# EAGLE design oeuil (EAGLE 6.3)
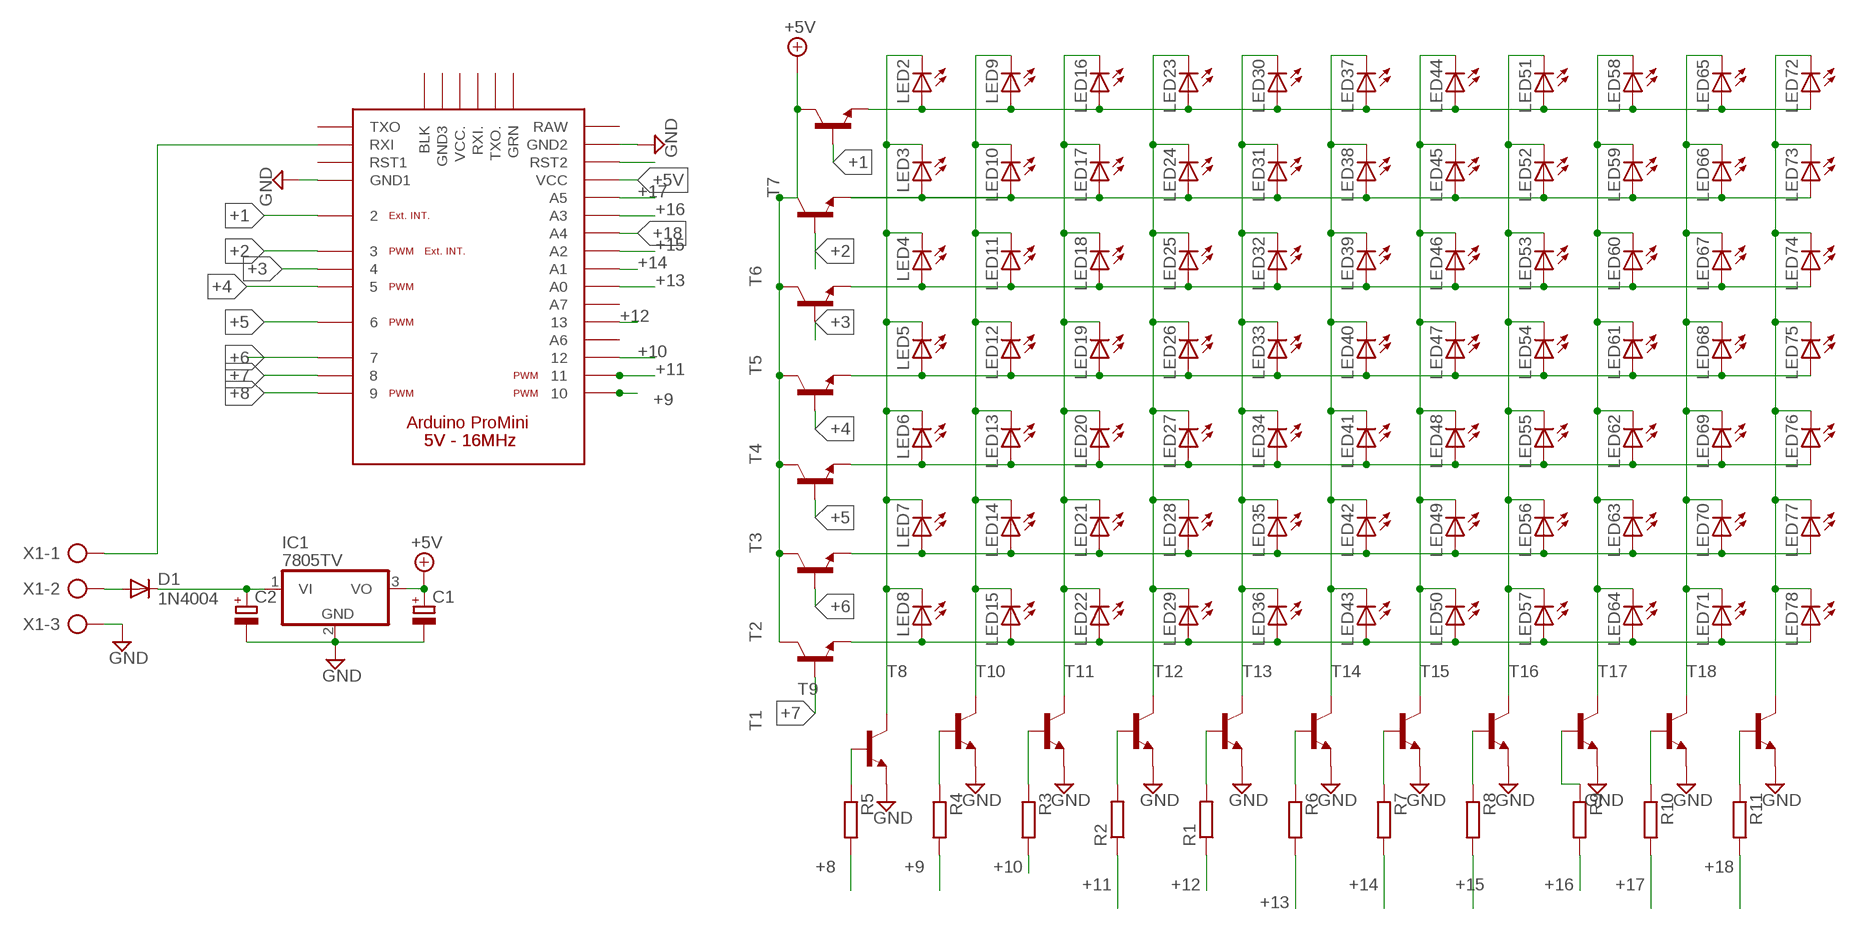
[diagram p0: schematic, sheet 1]

## Parts
C1  CPOL-EUE2,5-6E  [E2,5-6E]
C2  CPOL-EUE2,5-6E  [E2,5-6E]
D1  1N4004  [DO41-10]
IC1  7805TV  [TO220V]
LED2  LED3MM  [LED3MM]
LED3  LED3MM  [LED3MM]
LED4  LED3MM  [LED3MM]
LED5  LED3MM  [LED3MM]
LED6  LED3MM  [LED3MM]
LED7  LED3MM  [LED3MM]
LED8  LED3MM  [LED3MM]
LED9  LED3MM  [LED3MM]
LED10  LED3MM  [LED3MM]
LED11  LED3MM  [LED3MM]
LED12  LED3MM  [LED3MM]
LED13  LED3MM  [LED3MM]
LED14  LED3MM  [LED3MM]
LED15  LED3MM  [LED3MM]
LED16  LED3MM  [LED3MM]
LED17  LED3MM  [LED3MM]
LED18  LED3MM  [LED3MM]
LED19  LED3MM  [LED3MM]
LED20  LED3MM  [LED3MM]
LED21  LED3MM  [LED3MM]
LED22  LED3MM  [LED3MM]
LED23  LED3MM  [LED3MM]
LED24  LED3MM  [LED3MM]
LED25  LED3MM  [LED3MM]
LED26  LED3MM  [LED3MM]
LED27  LED3MM  [LED3MM]
LED28  LED3MM  [LED3MM]
LED29  LED3MM  [LED3MM]
LED30  LED3MM  [LED3MM]
LED31  LED3MM  [LED3MM]
LED32  LED3MM  [LED3MM]
LED33  LED3MM  [LED3MM]
LED34  LED3MM  [LED3MM]
LED35  LED3MM  [LED3MM]
LED36  LED3MM  [LED3MM]
LED37  LED3MM  [LED3MM]
LED38  LED3MM  [LED3MM]
LED39  LED3MM  [LED3MM]
LED40  LED3MM  [LED3MM]
LED41  LED3MM  [LED3MM]
LED42  LED3MM  [LED3MM]
LED43  LED3MM  [LED3MM]
LED44  LED3MM  [LED3MM]
LED45  LED3MM  [LED3MM]
LED46  LED3MM  [LED3MM]
LED47  LED3MM  [LED3MM]
LED48  LED3MM  [LED3MM]
LED49  LED3MM  [LED3MM]
LED50  LED3MM  [LED3MM]
LED51  LED3MM  [LED3MM]
LED52  LED3MM  [LED3MM]
LED53  LED3MM  [LED3MM]
LED54  LED3MM  [LED3MM]
LED55  LED3MM  [LED3MM]
LED56  LED3MM  [LED3MM]
LED57  LED3MM  [LED3MM]
LED58  LED3MM  [LED3MM]
LED59  LED3MM  [LED3MM]
LED60  LED3MM  [LED3MM]
LED61  LED3MM  [LED3MM]
LED62  LED3MM  [LED3MM]
LED63  LED3MM  [LED3MM]
LED64  LED3MM  [LED3MM]
LED65  LED3MM  [LED3MM]
LED66  LED3MM  [LED3MM]
LED67  LED3MM  [LED3MM]
LED68  LED3MM  [LED3MM]
LED69  LED3MM  [LED3MM]
LED70  LED3MM  [LED3MM]
LED71  LED3MM  [LED3MM]
LED72  LED3MM  [LED3MM]
LED73  LED3MM  [LED3MM]
LED74  LED3MM  [LED3MM]
LED75  LED3MM  [LED3MM]
LED76  LED3MM  [LED3MM]
LED77  LED3MM  [LED3MM]
LED78  LED3MM  [LED3MM]
R1  R-EU_0207/2V  [0207/2V]
R2  R-EU_0207/2V  [0207/2V]
R3  R-EU_0207/2V  [0207/2V]
R4  R-EU_0207/2V  [0207/2V]
R5  R-EU_0207/2V  [0207/2V]
R6  R-EU_0207/2V  [0207/2V]
R7  R-EU_0207/2V  [0207/2V]
R8  R-EU_0207/2V  [0207/2V]
R9  R-EU_0207/2V  [0207/2V]
R10  R-EU_0207/2V  [0207/2V]
R11  R-EU_0207/2V  [0207/2V]
T1  2N4124-NPN-TO92-CBE  [TO92-CBE]
T2  2N4124-NPN-TO92-CBE  [TO92-CBE]
T3  2N4124-NPN-TO92-CBE  [TO92-CBE]
T4  2N4124-NPN-TO92-CBE  [TO92-CBE]
T5  2N4124-NPN-TO92-CBE  [TO92-CBE]
T6  2N4124-NPN-TO92-CBE  [TO92-CBE]
T7  2N4124-NPN-TO92-CBE  [TO92-CBE]
T8  2N4124-NPN-TO92-CBE  [TO92-CBE]
T9  2N4124-NPN-TO92-CBE  [TO92-CBE]
T10  2N4124-NPN-TO92-CBE  [TO92-CBE]
T11  2N4124-NPN-TO92-CBE  [TO92-CBE]
T12  2N4124-NPN-TO92-CBE  [TO92-CBE]
T13  2N4124-NPN-TO92-CBE  [TO92-CBE]
T14  2N4124-NPN-TO92-CBE  [TO92-CBE]
T15  2N4124-NPN-TO92-CBE  [TO92-CBE]
T16  2N4124-NPN-TO92-CBE  [TO92-CBE]
T17  2N4124-NPN-TO92-CBE  [TO92-CBE]
T18  2N4124-NPN-TO92-CBE  [TO92-CBE]
U$1  ARDUINO_PRO_MINI  [ARDUINO_PRO_MINI]
X1  AK300/3  [AK300/3]

## Nets
+1: T7.B U$1.2
+2: T6.B U$1.3
+3: T5.B U$1.4
+4: T4.B U$1.5
+5: T3.B U$1.6
+5V: C1.+ IC1.3(VO) T1.C T2.C T3.C T4.C T5.C T6.C T7.C U$1.VCC1(VCC)
+6: T2.B U$1.7
+7: T1.B U$1.8
+8: R5.2 U$1.9
+9: R4.2 U$1.10
+10: R3.2 U$1.12
+11: R2.1 U$1.11
+12: R1.1 U$1.13
+13: R6.2 U$1.A0
+14: R7.2 U$1.A1
+15: R8.2 U$1.A2
+16: R9.2 U$1.A3
+17: R10.2 U$1.A5
+18: R11.2 U$1.A4
GND: C1.- C2.- IC1.2(GND) T8.E T9.E T10.E T11.E T12.E T13.E T14.E T15.E T16.E T17.E T18.E U$1.GND1 U$1.GND2 X1.3
N$1: C2.+ D1.C IC1.1(VI)
N$2: LED9.K(C) LED10.K(C) LED11.K(C) LED12.K(C) LED13.K(C) LED14.K(C) LED15.K(C) T8.C
N$3: LED16.K(C) LED17.K(C) LED18.K(C) LED19.K(C) LED20.K(C) LED21.K(C) LED22.K(C) T10.C
N$4: LED51.K(C) LED52.K(C) LED53.K(C) LED54.K(C) LED55.K(C) LED56.K(C) LED57.K(C) T15.C
N$5: LED23.K(C) LED24.K(C) LED25.K(C) LED26.K(C) LED27.K(C) LED28.K(C) LED29.K(C) T11.C
N$6: LED30.K(C) LED31.K(C) LED32.K(C) LED33.K(C) LED34.K(C) LED35.K(C) LED36.K(C) T12.C
N$7: LED37.K(C) LED38.K(C) LED39.K(C) LED40.K(C) LED41.K(C) LED42.K(C) LED43.K(C) T13.C
N$8: LED44.K(C) LED45.K(C) LED46.K(C) LED47.K(C) LED48.K(C) LED49.K(C) LED50.K(C) T14.C
N$9: LED58.K(C) LED59.K(C) LED60.K(C) LED61.K(C) LED62.K(C) LED63.K(C) LED64.K(C) T16.C
N$10: LED65.K(C) LED66.K(C) LED67.K(C) LED68.K(C) LED69.K(C) LED70.K(C) LED71.K(C) T17.C
N$11: LED72.K(C) LED73.K(C) LED74.K(C) LED75.K(C) LED76.K(C) LED77.K(C) LED78.K(C) T18.C
N$12: LED8.A LED15.A LED22.A LED29.A LED36.A LED43.A LED50.A LED57.A LED64.A LED71.A LED78.A T1.E
N$13: R5.1 T9.B
N$14: R4.1 T8.B
N$15: R3.1 T10.B
N$16: R2.2 T11.B
N$17: R1.2 T12.B
N$18: R6.1 T13.B
N$19: R7.1 T14.B
N$20: R8.1 T15.B
N$21: R9.1 T16.B
N$22: R10.1 T17.B
N$23: R11.1 T18.B
N$24: LED2.A LED9.A LED16.A LED23.A LED30.A LED37.A LED44.A LED51.A LED58.A LED65.A LED72.A T7.E
N$25: D1.A X1.2
N$26: U$1.RXI1(RXI) X1.1
N$27: LED6.A LED13.A LED20.A LED27.A LED34.A LED41.A LED48.A LED55.A LED62.A LED69.A LED76.A T3.E
N$29: LED7.A LED14.A LED21.A LED28.A LED35.A LED42.A LED49.A LED56.A LED63.A LED70.A LED77.A T2.E
N$30: LED5.A LED12.A LED19.A LED26.A LED33.A LED40.A LED47.A LED54.A LED61.A LED68.A LED75.A T4.E
N$31: LED4.A LED11.A LED18.A LED25.A LED32.A LED39.A LED46.A LED53.A LED60.A LED67.A LED74.A T5.E
N$32: LED3.A LED10.A LED17.A LED24.A LED31.A LED38.A LED45.A LED52.A LED59.A LED66.A LED73.A T6.E
N$33: LED2.K(C) LED3.K(C) LED4.K(C) LED5.K(C) LED6.K(C) LED7.K(C) LED8.K(C) T9.C
N$38: U$1.RST2
Unconnected: U$1.A6 U$1.A7 U$1.BLK U$1.GND3 U$1.GRN U$1.RAW U$1.RST1 U$1.RXI2(RXI.) U$1.TXO1(TXO) U$1.TXO2(TXO.) U$1.VCC2(VCC.)

## Library data of the parts
C1 C2 = resistor:CPOL-EU: POLARIZED CAPACITOR, European symbol
D1 = diode:1N4004: DIODE general purpose rectifier, 1 A
IC1 = linear:78*: Positive VOLTAGE REGULATOR Source: http://cache.national.com/ds/LM/LM78L05.pdf http://www.fairchildsemi.com/ds/LM/LM7805.pdf
LED2-LED78 = led:LED: LED OSRAM: - CHIPLED LG R971, LG N971, LY N971, LG Q971, LY Q971, LO R971, LY R971 LH N974, LH R974 LS Q976, LO Q976, LY Q976 LO Q996 - Hyper CHIPLED LW Q18S LB Q993, LB Q99A, LB R99A - SideLED LS A670, LO A670, LY A670, LG A670, LP A670 LB A673, LV A673, LT A673, LW A673 LH A674 LY A675 LS A676, LA A676, LO A676, LY A676, LW A676 LS A679, LY A679, LG A679 - Hyper Micro SIDELED® LS Y876, LA Y876, LO Y876, LY Y876 LT Y87S - SmartLED LW L88C, LW L88S LB L89C, LB L89S, LG L890 LS L89K, LO L89K, LY L89K LS L896, LA L896, LO L896, LY L896 - TOPLED LS T670, LO T670, LY T670, LG T670, LP T670 LSG T670, LSP T670, LSY T670, LOP T670, LYG T670 LG T671, LOG T671, LSG T671 LB T673, LV T673, LT T673, LW T673 LH T674 LS T676, LA T676, LO T676, LY T676, LB T676, LH T676, LSB T676, LW T676 LB T67C, LV T67C, LT T67C, LS T67K, LO T67K, LY T67K, LW E67C LS E67B, LA E67B, LO E67B, LY E67B, LB E67C, LV E67C, LT E67C LW T67C LS T679, LY T679, LG T679 LS T770, LO T770, LY T770, LG T770, LP T770 LB T773, LV T773, LT T773, LW T773 LH T774 LS E675, LA E675, LY E675, LS T675 LS T776, LA T776, LO T776, LY T776, LB T776 LHGB T686 LT T68C, LB T68C - Hyper Mini TOPLED® LB M676 - Mini TOPLED Santana® LG M470 LS M47K, LO M47K, LY M47K Source: http://www.osram.convergy.de LUXEON: - LUMILED® LXK2-PW12-R00, LXK2-PW12-S00, LXK2-PW14-U00, LXK2-PW14-V00 LXK2-PM12-R00, LXK2-PM12-S00, LXK2-PM14-U00 LXK2-PE12-Q00, LXK2-PE12-R00, LXK2-PE12-S00, LXK2-PE14-T00, LXK2-PE14-U00 LXK2-PB12-K00, LXK2-PB12-L00, LXK2-PB12-M00, LXK2-PB14-N00, LXK2-PB14-P00, LXK2-PB14-Q00 LXK2-PR12-L00, LXK2-PR12-M00, LXK2-PR14-Q00, LXK2-PR14-R00 LXK2-PD12-Q00, LXK2-PD12-R00, LXK2-PD12-S00 LXK2-PH12-R00, LXK2-PH12-S00 LXK2-PL12-P00, LXK2-PL12-Q00, LXK2-PL12-R00 Source: www.luxeon.com KINGBRIGHT: KA-3528ASYC Source: www.kingbright.com
R1-R11 = resistor:R-EU_: RESISTOR, European symbol
T1-T18 = transistor:*-NPN-: NPN Transistror BF959 corrected 2008.03.06
U$1 = arduino:ARDUINO_PRO_MINI
X1 = con-ptr500:AK300/3: CONNECTOR; OC_FARNELL: unknown; OC_NEWARK: unknown

## Board
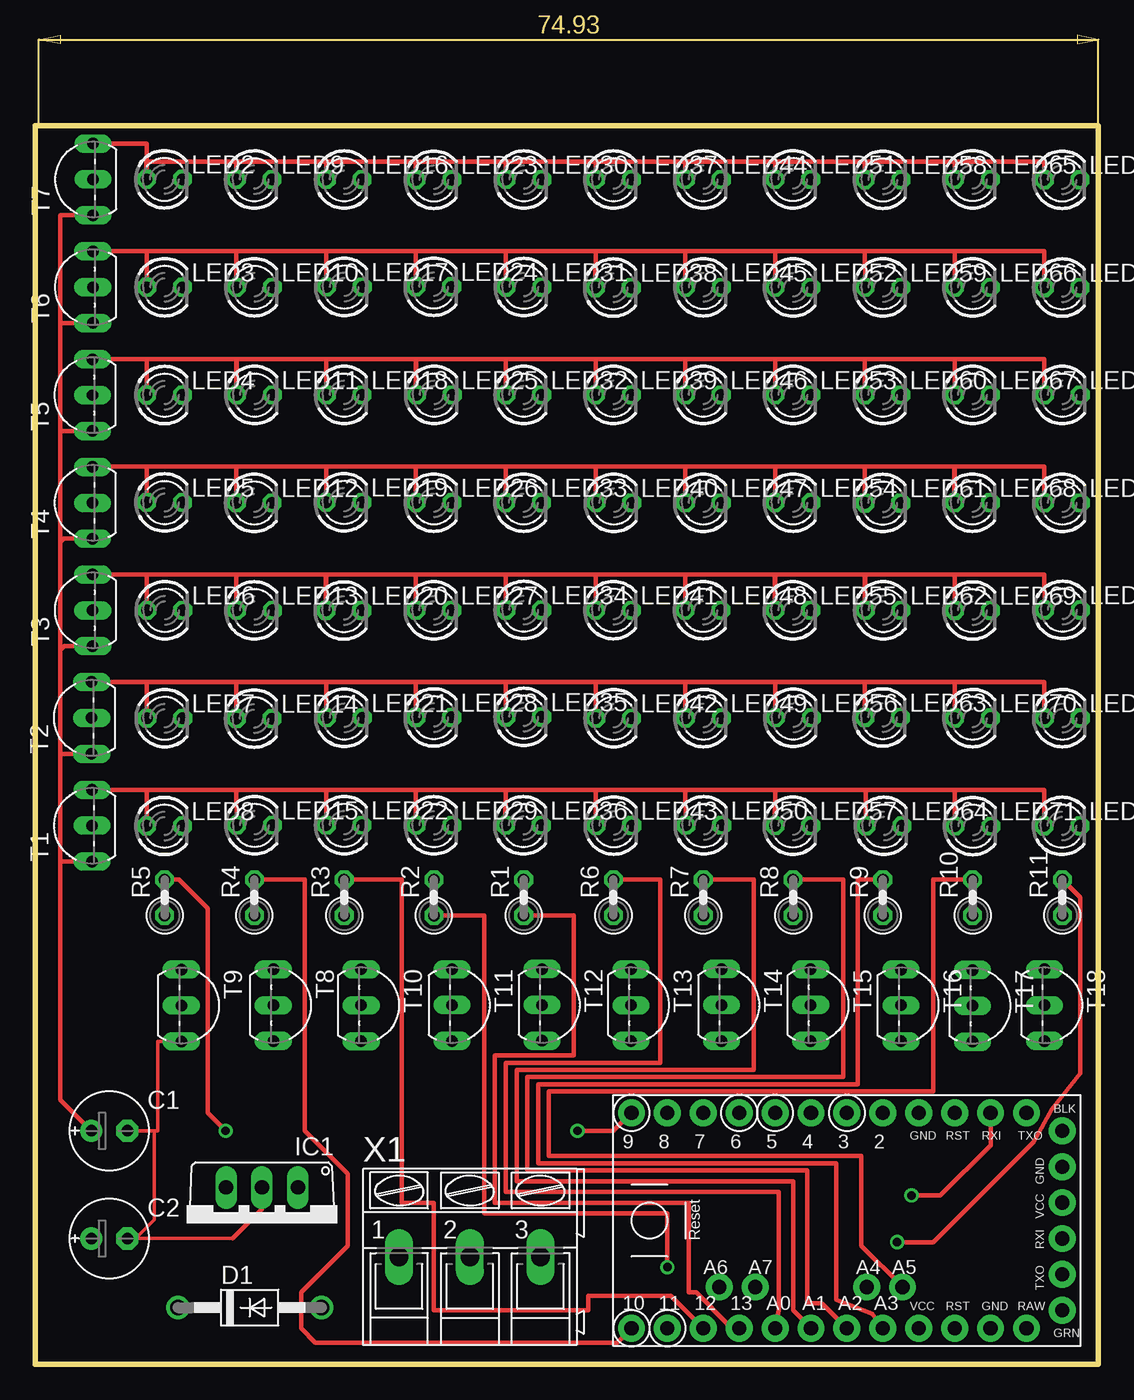
[diagram p1: board, top side]
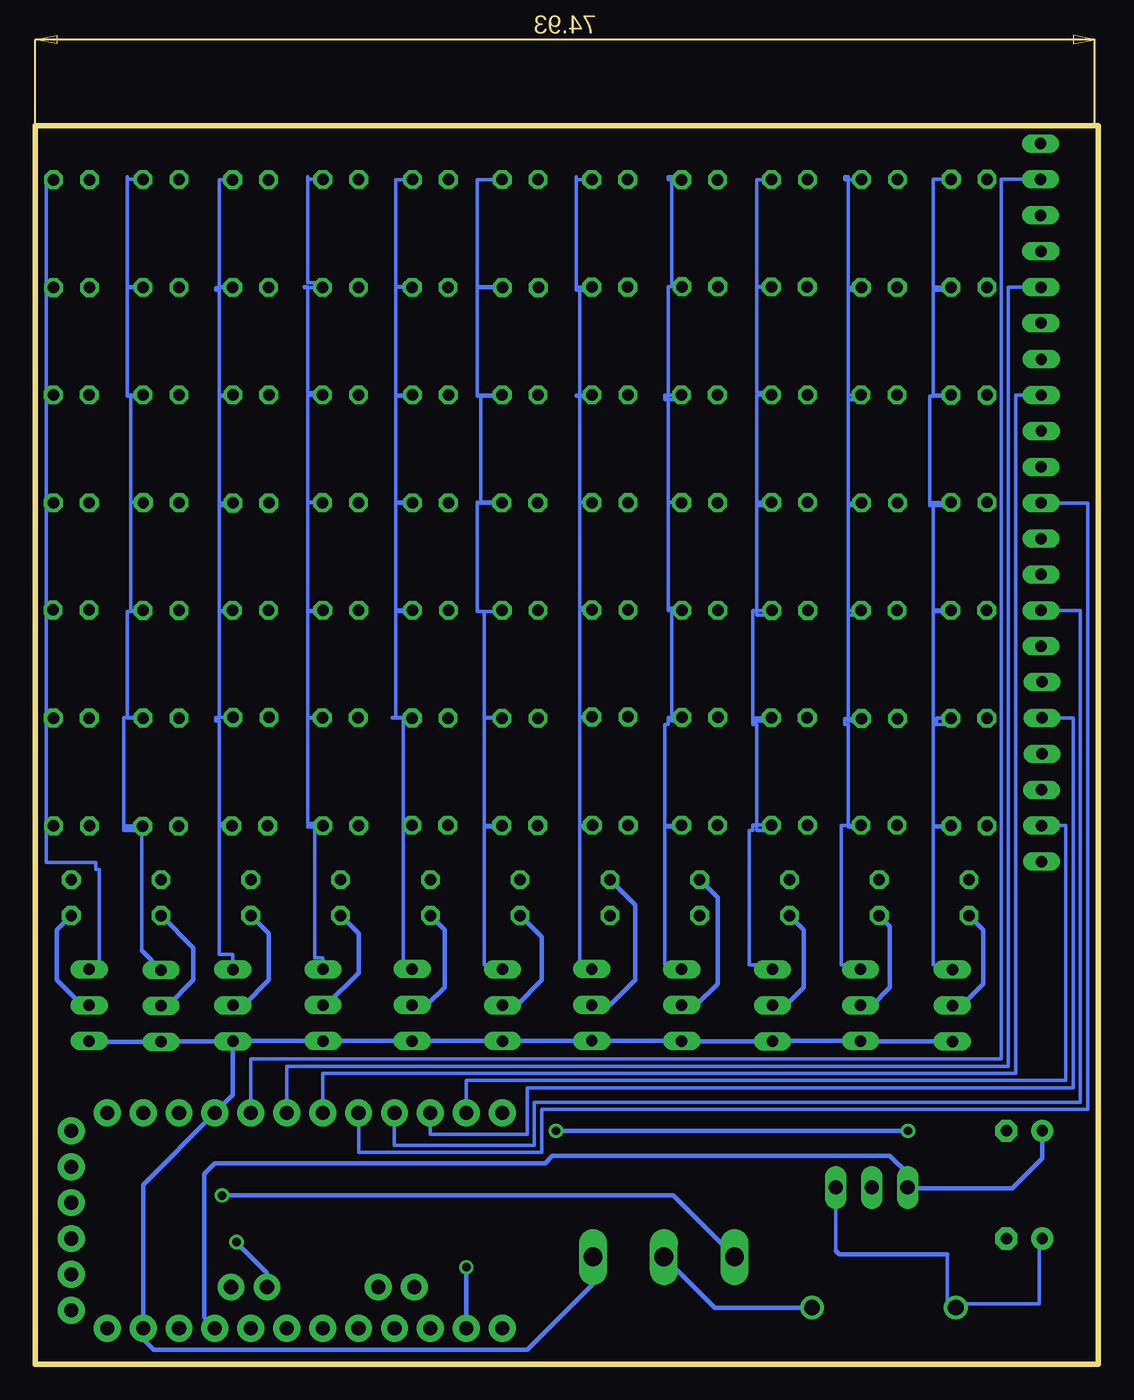
[diagram p2: board, bottom side, seen from below]

Size 75.18 x 87.63 mm. Coordinates in mm from the lower left corner, seen from the top.
Outline: 0,87.63 75.18,87.63 75.18,0 0,0 0,87.63
Copper layers (1*16): Top 0.035mm / dielectric 1.5mm / Bottom 0.035mm
Design rules "default *": minimum track width 8mil, minimum drill 20mil, track to track 8mil, track to pad 8mil, pad to pad 8mil, via to via 8mil, smd to smd 8mil, copper to edge 10mil, drill to drill 8mil, minimum pad ring 10mil, minimum via ring 8mil, stop-mask expansion 4mil, vias tented up to drill 0mil, thermal gap 10mil

### Footprints (pad centres in the part's own frame; a part is rotated, then mirrored left to right if it is on the bottom)
E2,5-6E = drill 0.813 pad 1.575: + -1.27,0 | drill 0.813 pad 1.575 octagon: - 1.27,0
DO41-10 = drill 1.118: A 5.08,0; C -5.08,0
TO220V = drill 1.016 long: 1 -2.54,-2.54; 2 0,-2.54; 3 2.54,-2.54
LED3MM = drill 0.813 octagon: A -1.27,0; K 1.27,0
0207/2V = drill 0.813 octagon: 1 -1.27,0; 2 1.27,0
TO92-CBE = drill 0.813 long: B 0,0; C -2.54,0; E 2.54,0
ARDUINO_PRO_MINI = drill 1 pad 1.9: 2 -7.62,2.54; 3 -7.62,0; 4 -7.62,-2.54; 5 -7.62,-5.08; 6 -7.62,-7.62; 7 -7.62,-10.16; 8 -7.62,-12.7; 9 -7.62,-15.24; 10 7.62,-15.24; 11 7.62,-12.7; 12 7.62,-10.16; 13 7.62,-7.62; A0 7.62,-5.08; A1 7.62,-2.54; A2 7.62,0; A3 7.62,2.54; A4 4.699,1.397; A5 4.699,3.937; A6 4.699,-9.017; A7 4.699,-6.477; BLK -6.35,15.24; GND1 -7.62,5.08; GND2 7.62,10.16; GND3 -3.81,15.24; GRN 6.35,15.24; RAW 7.62,12.7; RST1 -7.62,7.62; RST2 7.62,7.62; RXI1 -7.62,10.16; RXI2 1.27,15.24; TXO1 -7.62,12.7; TXO2 3.81,15.24; VCC1 7.62,5.08; VCC2 -1.27,15.24
AK300/3 = drill 1.321 long: 1 -5.004,0; 2 0,0; 3 5.004,0

### Placement (x,y rotation side)
C1  5.23,16.51 0 top
C2  5.23,8.89 0 top
D1  15.16,4 0 top
IC1  16.03,9.97 180 top
LED2  9.13,83.84 0 top
LED3  9.15,76.2 0 top
LED4  9.14,68.57 0 top
LED5  9.14,60.97 0 top
LED6  9.16,53.35 0 top
LED7  9.15,45.71 0 top
LED8  9.13,38.08 0 top
LED9  15.48,83.82 0 top
LED10  15.49,76.2 0 top
LED11  15.51,68.58 0 top
LED12  15.48,60.95 0 top
LED13  15.5,53.33 0 top
LED14  15.48,45.68 0 top
LED15  15.51,38.13 0 top
LED16  21.84,83.82 0 top
LED17  21.86,76.23 0 top
LED18  21.84,68.58 0 top
LED19  21.83,60.99 0 top
LED20  21.82,53.33 0 top
LED21  21.86,45.73 0 top
LED22  21.84,38.14 0 top
LED23  28.19,83.81 0 top
LED24  28.18,76.24 0 top
LED25  28.22,68.58 0 top
LED26  28.19,60.96 0 top
LED27  28.18,53.34 0 top
LED28  28.18,45.76 0 top
LED29  28.19,38.13 0 top
LED30  34.56,83.82 0 top
LED31  34.56,76.21 0 top
LED32  34.54,68.58 0 top
LED33  34.53,60.96 0 top
LED34  34.54,53.37 0 top
LED35  34.54,45.8 0 top
LED36  34.52,38.13 0 top
LED37  40.89,83.82 0 top
LED38  40.88,76.17 0 top
LED39  40.89,68.58 0 top
LED40  40.92,60.95 0 top
LED41  40.89,53.35 0 top
LED42  40.91,45.71 0 top
LED43  40.92,38.11 0 top
LED44  47.24,83.82 0 top
LED45  47.26,76.2 0 top
LED46  47.24,68.58 0 top
LED47  47.24,60.95 0 top
LED48  47.23,53.35 0 top
LED49  47.26,45.72 0 top
LED50  47.28,38.13 0 top
LED51  53.58,83.83 0 top
LED52  53.59,76.19 0 top
LED53  53.59,68.58 0 top
LED54  53.59,60.96 0 top
LED55  53.58,53.34 0 top
LED56  53.62,45.73 0 top
LED57  53.58,38.1 0 top
LED58  59.96,83.81 0 top
LED59  59.96,76.19 0 top
LED60  59.94,68.58 0 top
LED61  59.94,60.93 0 top
LED62  59.97,53.34 0 top
LED63  59.93,45.76 0 top
LED64  60.02,38.09 0 top
LED65  66.29,83.83 0 top
LED66  66.29,76.19 0 top
LED67  66.29,68.58 0 top
LED68  66.28,60.96 0 top
LED69  66.29,53.33 0 top
LED70  66.29,45.72 0 top
LED71  66.32,38.07 0 top
LED72  72.63,83.81 0 top
LED73  72.63,76.17 0 top
LED74  72.64,68.58 0 top
LED75  72.64,60.95 0 top
LED76  72.66,53.37 0 top
LED77  72.64,45.72 0 top
LED78  72.62,38.09 0 top
R1  34.54,33.02 90 top
R2  28.19,33.02 90 top
R3  21.84,33.02 90 top
R4  15.49,33.02 90 top
R5  9.14,33.02 90 top
R6  40.89,33.02 90 top
R7  47.24,33.02 90 top
R8  53.59,33.02 90 top
R9  59.94,33.02 90 top
R10  66.29,33.02 90 top
R11  72.64,33.02 90 top
T1  4,38.1 90 top
T2  3.99,45.73 90 top
T3  4.06,53.34 90 top
T4  4.05,60.95 90 top
T5  4.03,68.57 90 top
T6  4.07,76.21 90 top
T7  4.09,83.83 90 top
T8  16.83,25.4 270 top
T9  10.33,25.38 270 top
T10  23.05,25.39 270 top
T11  29.47,25.4 270 top
T12  35.83,25.42 270 top
T13  42.14,25.4 270 top
T14  48.53,25.41 270 top
T15  54.84,25.41 270 top
T16  61.22,25.39 270 top
T17  66.3,25.35 270 top
T18  71.37,25.4 270 top
U$1  57.4,10.16 270 top
X1  30.73,7.59 0 top

### Tracks (layer width: path | path; a pad name or v marks a point on that pad's centre or on a via)
+1
  Bottom 0.254: T7.B 6.86,83.83 6.86,21.59 59.94,21.59 U$1.2
+2
  Bottom 0.254: T6.B 6.35,76.21 6.35,21.08 57.4,21.08 U$1.3
+3
  Bottom 0.254: T5.B 5.84,68.57 5.84,20.57 54.86,20.57 U$1.4
+4
  Bottom 0.254: T4.B 0.76,60.95 0.76,18.03 39.37,18.03 39.37,14.99 52.32,14.99 U$1.5
+5
  Bottom 0.254: T3.B 1.27,53.34 1.27,18.54 39.88,18.54 39.88,15.49 49.78,15.49 U$1.6
+5V
  Top 0.305: T7.C 1.78,81.29 1.78,73.67 | 1.78,73.66 T6.C 1.78,73.67 | 1.78,73.67 1.78,73.66 | 1.78,73.66 1.78,66.04 | 1.78,66.04 1.78,58.17 | 1.78,58.17 1.78,50.55 | 1.78,50.55 1.78,43.18 | 1.78,43.18 1.78,35.56 | 1.78,35.56 1.78,18.69 C1.+ | T5.C 1.79,66.03 1.78,66.04 | T4.C 2.02,58.41 1.78,58.17 | T3.C 2.04,50.8 1.78,50.55 | T2.C 1.79,43.19 1.78,43.18 | T1.C 4.06,35.56 1.78,35.56
  Bottom 0.305: C1.+ 3.96,14.58 6.1,12.45 13.42,12.45 IC1.3 13.49,13.49 14.73,14.73 38.61,14.73 39.12,14.22 62.48,14.22 63.25,13.46 63.25,3.3 U$1.VCC1
+6
  Bottom 0.254: T2.B 1.78,45.73 1.78,19.56 40.39,19.56 40.39,16.26 47.24,16.26 U$1.7
+7
  Bottom 0.254: T1.B 2.29,38.1 2.29,20.07 44.7,20.07 U$1.8
+8  (via drill 0.6)
  Top 0.305: R5.2 10.16,34.29 12.19,32.26 12.19,17.78 v13.46,16.51 | v38.35,16.51 40.89,16.51 U$1.9
  Bottom 0.305: v13.46,16.51 v38.35,16.51
+9
  Top 0.305: R4.2 19.05,34.29 19.05,16.51 22.1,13.46 22.1,8.38 18.8,5.08 18.8,2.54 19.81,1.52 41.15,1.52 U$1.10
+10
  Top 0.305: R3.2 25.91,34.29 25.91,11.43 28.19,11.43 28.19,3.81 39.12,3.81 39.12,4.83 44.96,4.83 U$1.12
+11  (via drill 0.6)
  Top 0.305: R2.1 31.75,31.75 31.75,10.67 44.7,10.67 v44.7,6.86
  Bottom 0.305: v44.7,6.86 U$1.11
+12
  Top 0.305: R1.1 38.1,31.75 38.1,21.84 32.51,21.84 32.51,11.43 46.23,11.43 46.23,5.08 46.74,5.08 49.02,2.79 49.53,2.79 U$1.13
+13
  Top 0.305: R6.2 44.2,34.29 44.2,21.34 33.27,21.34 33.27,12.19 52.58,12.19 52.58,3.81 U$1.A0
+14
  Top 0.305: R7.2 50.8,34.29 50.8,20.83 34.04,20.83 34.04,12.95 53.59,12.95 53.59,3.81 U$1.A1
+15
  Top 0.305: R8.2 57.15,34.29 57.15,20.32 34.8,20.32 34.8,13.72 54.61,13.72 54.61,4.32 55.63,4.32 U$1.A2
+16
  Top 0.305: R9.2 58.17,34.29 58.17,19.81 35.56,19.81 35.56,14.22 56.64,14.22 56.64,4.57 59.18,3.56 U$1.A3
+17
  Top 0.305: R10.2 63.5,34.29 63.5,19.3 36.32,19.3 36.32,14.73 58.42,14.73 58.42,8.38 U$1.A5
+18  (via drill 0.6)
  Top 0.305: R11.2 73.91,33.02 73.91,20.57 71.88,18.03 70.61,15.75 63.5,8.64 v60.96,8.64
  Bottom 0.305: v60.96,8.64 58.8,6.48 U$1.A4
GND
  Top 0.254: T9.E 8.67,22.84 8.67,16.51 8.38,16.51 | C1.- 8.38,16.51 | C2.- 7.11,8.89 | 7.11,8.89 13.97,8.89 | 7.11,8.89 8.42,10.2 8.42,16.47 8.38,16.51
  Top 0.305: IC1.2 16.03,10.95 13.97,8.89
  Bottom 0.305: X1.3 35.81,7.52 35.81,5.59 40.39,1.02 66.8,1.02 67.56,1.78 U$1.GND2 67.56,12.7 U$1.GND1 61.22,19.05 T16.E | T9.E 16.8,22.84 T8.E 23.04,22.86 T10.E T11.E 35.82,22.87 T12.E 42.13,22.88 T13.E T14.E T15.E 61.21,22.87 T16.E | T16.E 66.26,22.85 T17.E 71.33,22.81 T18.E
N$1
  Bottom 0.254: C2.+ 4.17,8.89 4.17,4.26 10.08,4.26 D1.C 10.67,4 10.67,7.76 | 18.57,8.01 IC1.1
  Bottom 0.305: 10.67,7.76 18.32,7.76 18.57,8.01
N$2
  Bottom 0.254: LED9.K 17.92,83.82 17.92,84.01 17.67,84.01 17.67,76.01 16.76,76.01 LED10.K 17.67,76.2 17.67,68.26 16.78,68.26 LED11.K 17.67,68.58 17.67,60.76 16.75,60.76 LED12.K 17.67,60.95 17.67,53.01 16.77,53.01 LED13.K 17.67,53.33 17.67,45.51 16.75,45.51 LED14.K 17.92,45.68 17.92,45.26 17.67,45.26 17.67,38.01 16.78,38.01 LED15.K 18.17,38.13 18.17,28.26 16.83,28.26 T8.C
N$3
  Bottom 0.254: LED16.K 24.17,83.82 24.17,76.26 23.13,76.26 LED17.K 24.17,76.23 24.17,68.76 23.11,68.76 LED18.K 24.17,68.58 24.17,60.98 | 24.17,60.76 23.1,60.76 LED19.K 24.17,60.98 | 24.17,60.98 24.17,60.76 | 24.17,60.76 24.17,53.01 23.09,53.01 LED20.K 24.42,53.33 24.42,45.51 23.13,45.51 LED21.K 24.42,45.73 24.42,45.26 24.17,45.26 24.17,37.76 23.11,37.76 LED22.K 24.42,38.14 24.42,37.76 24.67,37.76 24.67,28.26 23.05,28.26 T10.C
N$4
  Bottom 0.254: LED51.K 55.92,83.83 | 55.92,83.83 55.92,84.01 | 55.92,83.83 55.92,76.51 54.86,76.51 LED52.K 56.17,76.19 56.17,76.26 55.92,76.26 55.92,68.76 54.86,68.76 LED53.K 55.92,68.58 55.92,61.01 | 55.92,61.01 54.86,61.01 LED54.K 55.92,60.96 | 55.92,60.96 55.92,61.01 | 55.92,60.96 55.92,53.26 54.85,53.26 LED55.K 55.92,53.34 55.92,45.76 54.89,45.76 LED56.K 55.92,45.73 55.92,38.26 54.85,38.26 LED57.K 55.92,38.1 55.92,38.01 55.42,38.01 55.42,28.76 54.84,28.76 T15.C
N$5
  Bottom 0.254: LED23.K 30.42,83.81 30.42,84.01 30.17,84.01 30.17,76.26 29.45,76.26 LED24.K 30.42,76.24 | 30.42,76.24 30.42,76.26 | 30.42,76.24 30.42,68.26 | 30.42,68.26 29.49,68.26 LED25.K 30.67,68.58 30.67,68.26 30.42,68.26 | 30.42,68.26 30.42,61.01 29.46,61.01 LED26.K 30.42,60.96 30.42,53.51 | 30.17,53.51 29.45,53.51 LED27.K 30.42,53.34 30.42,53.51 | 30.42,53.51 30.17,53.51 | 30.17,53.51 30.17,45.51 29.45,45.51 LED28.K 30.42,45.76 30.42,45.26 30.67,45.26 30.67,38.01 29.46,38.01 LED29.K 30.67,38.12 30.67,28.26 29.46,28.26 T11.C
N$6
  Bottom 0.254: LED30.K 36.92,83.82 | 36.92,83.82 36.92,84.01 | 36.92,83.82 36.92,76.21 | 36.67,76.01 35.83,76.01 LED31.K 36.92,76.21 | 36.92,76.21 36.92,76.01 36.67,76.01 | 36.67,76.01 36.67,68.51 | 36.67,68.51 35.81,68.51 LED32.K 36.92,68.58 36.92,68.51 36.67,68.51 | 36.67,68.51 36.67,61.01 | 36.67,61.01 35.8,61.01 LED33.K 36.67,60.96 | 36.67,60.96 36.67,61.01 | 36.67,60.96 36.67,53.51 35.81,53.51 LED34.K 36.67,53.36 36.67,45.8 | 36.67,45.76 35.81,45.76 LED35.K 36.67,45.8 | 36.67,45.8 36.67,45.76 | 36.67,45.76 36.67,38.12 | 36.67,38.01 35.79,38.01 LED36.K 36.67,38.12 | 36.67,38.12 36.67,38.01 | 36.67,38.01 36.67,28.26 35.83,28.26 T12.C
N$7
  Bottom 0.254: LED37.K 43.92,83.82 43.92,76.26 42.15,76.26 LED38.K 43.92,76.17 43.92,68.58 | 43.67,68.51 42.16,68.51 LED39.K 43.92,68.58 | 43.92,68.58 43.92,68.51 43.67,68.51 | 43.67,68.51 43.67,61.01 42.19,61.01 LED40.K 43.92,60.95 | 43.92,60.95 43.92,61.01 | 43.92,60.95 43.92,53.26 43.42,53.26 | 42.42,53.26 42.16,53.26 LED41.K 42.42,53.35 42.42,53.26 | 42.42,53.26 43.42,53.26 | 43.42,53.26 43.42,45.76 42.18,45.76 LED42.K 43.42,45.71 43.42,38.01 42.19,38.01 LED43.K 43.42,38.11 43.42,28.26 42.14,28.26 T13.C
N$8
  Bottom 0.254: LED44.K 49.67,83.82 49.67,76.26 | 49.67,76.26 48.53,76.26 LED45.K 49.67,76.2 | 49.67,76.2 49.67,76.26 | 49.67,76.2 49.67,68.58 | 49.67,68.51 48.51,68.51 LED46.K 49.67,68.58 | 49.67,68.58 49.67,68.51 | 49.67,68.51 49.67,61.01 48.51,61.01 LED47.K 49.67,60.95 49.67,53.35 | 49.67,53.26 48.5,53.26 LED48.K 49.67,53.35 | 49.67,53.35 49.67,53.26 | 49.67,53.26 49.67,45.76 48.53,45.76 LED49.K 49.92,45.72 49.92,45.76 49.17,45.76 49.17,38.12 | 49.17,38.01 48.55,38.01 LED50.K 49.17,38.12 | 49.17,38.12 49.17,38.01 | 49.17,38.01 49.17,28.26 48.53,28.26 T14.C
N$9
  Bottom 0.254: LED58.K 62.17,83.81 62.17,76.26 61.23,76.26 LED59.K 62.42,76.19 62.42,76.01 62.17,76.01 62.17,68.58 | 62.17,68.58 62.17,68.51 | 62.17,68.51 61.21,68.51 LED60.K 62.17,68.58 | 62.17,68.51 62.17,60.76 61.67,60.76 61.67,61.01 61.21,61.01 LED61.K 62.17,60.94 62.17,53.34 | 62.17,53.26 61.24,53.26 LED62.K 62.17,53.34 | 62.17,53.34 62.17,53.26 | 62.17,53.26 62.17,45.76 LED63.K 62.42,45.76 62.42,45.51 62.17,45.51 62.17,38.26 | 62.17,38.26 61.29,38.26 LED64.K 62.17,38.09 | 62.17,38.09 62.17,38.26 | 62.17,38.09 62.17,29.01 61.22,29.01 T16.C
N$10
  Bottom 0.254: LED65.K 68.67,83.83 | 68.67,83.83 68.67,84.01 | 68.67,83.83 68.67,76.26 | 68.67,76.26 67.56,76.26 LED66.K 68.67,76.19 | 68.67,76.19 68.67,76.26 | 68.67,76.19 68.67,68.58 | 68.42,68.51 67.56,68.51 LED67.K 68.67,68.58 | 68.67,68.58 68.67,68.51 68.42,68.51 | 68.42,68.51 68.42,61.01 67.55,61.01 LED68.K 68.42,60.96 68.42,53.33 | 68.42,53.26 67.56,53.26 LED69.K 68.42,53.33 | 68.42,53.33 68.42,53.26 | 68.42,53.26 68.67,53.26 68.67,45.76 | 68.67,45.76 67.56,45.76 LED70.K 68.67,45.72 68.67,45.76 | 68.67,45.76 68.92,45.76 68.92,38.08 | 68.92,38.01 68.92,37.76 67.59,37.76 LED71.K 68.92,38.08 | 68.92,38.08 68.92,38.01 | 68.92,38.01 67.67,38.01 67.67,29.26
  Bottom 0.305: 67.67,29.26 66.31,27.89 T17.C
N$11
  Bottom 0.254: T18.C 70.67,27.94 70.67,35.01 70.92,35.01 70.92,35.51 74.42,35.51 74.42,38.26 73.89,38.26 LED78.K 74.42,38.09 74.42,45.76 73.91,45.76 LED77.K 74.42,45.72 74.42,53.51 73.93,53.51 LED76.K 74.42,53.36 74.42,61.01 73.91,61.01 LED75.K 74.42,60.95 74.42,68.76 73.91,68.76 LED74.K 74.42,68.58 74.42,76.26 73.9,76.26 LED73.K 74.42,76.17 74.42,83.76 73.9,83.76 LED72.K
  Bottom 0.305: LED72.K
N$12
  Top 0.305: T1.E 7.87,40.64 | LED8.A 7.87,40.64 | 7.87,40.64 14.22,40.64 | LED15.A 14.22,40.64 | 14.22,40.64 20.57,40.64 | LED22.A 20.57,40.64 | 20.57,40.64 26.92,40.64 | LED29.A 26.92,40.64 | 26.92,40.64 33.27,40.64 | LED36.A 33.27,40.64 | 33.27,40.64 39.62,40.64 | LED43.A 39.62,40.64 | 39.62,40.64 45.97,40.64 | LED50.A 45.97,40.64 | 45.97,40.64 52.32,40.64 | LED57.A 52.32,40.64 | 52.32,40.64 58.75,40.64 | LED64.A 58.75,40.64 | 65.05,40.64 58.75,40.64 | LED71.A 65.05,40.64 | 65.05,40.64 71.37,40.64 71.37,38.1 arc-90 71.36,38.09 LED78.A
N$13
  Bottom 0.305: T9.B 9.67,25.38 8.13,26.92 8.13,30.73 R5.1
N$14
  Bottom 0.305: T8.B 16,25.4 14.73,26.67 14.73,30.99 R4.1
N$15
  Bottom 0.305: T10.B 22.1,25.39 20.83,26.67 20.83,30.73 R3.1
N$16
  Bottom 0.305: T11.B 28.44,25.41 26.92,26.92 26.92,33.02 R2.2
N$17
  Bottom 0.305: T12.B 34.53,25.42 32.77,27.18 32.77,32.51 R1.2
N$18
  Bottom 0.305: T13.B 41.15,25.4 39.37,27.18 39.37,30.23 R6.1
N$19
  Bottom 0.305: T14.B 47.48,25.41 46.23,26.67 46.23,30.73 R7.1
N$20
  Bottom 0.305: T15.B 54.6,25.41 52.32,27.69 52.32,30.48 R8.1
N$21
  Bottom 0.305: T16.B 60.46,25.39 58.67,27.18 58.67,30.48 R9.1
N$22
  Bottom 0.305: T17.B 65.83,25.35 64.01,27.18 64.01,29.46 R10.1
N$23
  Bottom 0.305: T18.B 71.88,25.4 73.66,27.18 73.66,30.73 R11.1
N$24
  Top 0.305: 14.22,85.09 7.87,85.09 LED2.A 7.87,86.36 6.6,86.36 T7.E | LED9.A 14.22,85.09 | 14.22,85.09 20.57,85.09 | LED16.A 20.57,85.09 | 20.57,85.09 26.92,85.09 | LED23.A 26.92,85.09 | 26.92,85.09 33.27,85.09 | LED30.A 33.27,85.09 | 33.27,85.09 39.62,85.09 | LED37.A 39.62,85.09 | 39.62,85.09 45.97,85.09 | LED44.A 45.97,85.09 | 45.97,85.09 52.32,85.09 | LED51.A 52.32,85.09 | 52.32,85.09 58.67,85.09 | LED58.A 58.67,85.09 | 58.67,85.09 65.02,85.09 | LED65.A 65.02,85.09 | 65.02,85.09 71.37,85.09 LED72.A
N$25
  Bottom 0.305: D1.A 27.14,4 X1.2
N$26  (via drill 0.6)
  Top 0.305: v61.98,11.94 64.01,11.94 67.56,15.49 U$1.RXI1
  Bottom 0.305: X1.1 30.07,11.94 v61.98,11.94
N$27
  Top 0.305: T3.E 7.87,55.88 | 7.87,55.88 7.89,55.86 LED6.A 7.87,53.36 7.87,55.88 | 7.87,55.88 14.22,55.88 | 14.22,55.88 14.23,55.88 LED13.A 14.22,55.88 | 14.22,55.88 20.57,55.88 | 20.57,55.88 20.55,55.86 LED20.A 20.57,53.35 20.57,55.88 | 20.57,55.88 26.92,55.88 | 26.92,55.88 26.91,55.87 LED27.A 26.92,53.35 26.92,55.88 | 26.92,55.88 33.27,55.88 | LED34.A 33.27,55.88 | 33.27,55.88 39.62,55.88 | LED41.A 39.62,55.88 | 39.62,55.88 45.97,55.88 | 45.97,55.88 45.96,55.87 LED48.A 45.97,53.36 45.97,55.88 | 45.97,55.88 52.32,55.88 | 52.32,55.88 52.31,55.87 LED55.A 52.32,53.35 52.32,55.88 | 52.32,55.88 58.67,55.88 | 58.67,55.88 58.7,55.86 LED62.A | LED62.A 58.67,53.36 58.67,55.88 | LED76.A 71.37,55.88 65.02,55.88 | LED62.A 58.67,55.88 | 58.67,55.88 65.02,55.88 | 65.02,55.88 LED69.A
N$29
  Top 0.305: T2.E 7.87,48.26 | LED7.A 7.87,48.26 | 7.87,48.26 14.22,48.26 | 14.22,48.26 14.22,45.72 14.21,45.7 LED14.A | 14.22,48.26 20.57,48.26 | 33.27,48.26 26.92,48.26 | 26.92,48.26 20.57,48.26 | LED35.A 33.27,48.26 | 33.27,48.26 39.62,48.26 | LED42.A 39.62,48.26 | 39.62,48.26 45.97,48.26 | LED49.A 45.97,48.26 | 45.97,48.26 52.32,48.26 | LED56.A 52.32,48.26 | 52.32,48.26 58.67,48.26 | LED63.A 58.67,48.26 | 58.67,48.26 65.02,48.26 | LED21.A 20.57,48.26 | LED70.A 65.02,48.26 | 65.02,48.26 71.37,48.26 LED77.A | LED28.A 26.91,48.25 26.92,48.26
N$30
  Top 0.305: T4.E 7.87,63.5 | 7.87,63.5 LED5.A 7.87,63.5 | 7.87,63.5 14.22,63.5 | 14.22,63.5 14.21,63.49 LED12.A 14.22,63.5 | 14.22,63.5 20.57,63.5 | 20.57,63.5 20.56,63.49 LED19.A 20.57,63.5 | 20.57,63.5 26.92,63.5 | LED26.A 26.92,63.5 | 26.92,63.5 33.27,63.5 | 33.27,63.5 33.26,63.49 LED33.A 33.27,63.5 | 33.27,63.5 39.62,63.5 | 39.62,63.5 39.65,63.48 LED40.A 39.62,60.97 39.62,63.5 | 39.62,63.5 45.97,63.5 | LED47.A 45.97,63.5 | 45.97,63.5 52.32,63.5 | LED54.A 52.32,63.5 | 52.32,63.5 58.67,63.5 | LED61.A 58.67,63.5 | 58.67,63.5 65.02,63.5 | 65.02,63.5 65.01,63.49 LED68.A 65.02,60.97 65.02,63.5 | 65.02,63.5 71.37,63.5 LED75.A
N$31
  Top 0.305: T5.E 4.05,71.12 7.87,71.12 | 7.87,71.12 7.87,71.11 LED4.A 7.87,71.12 | 7.87,71.12 14.22,71.12 | 14.22,71.12 14.24,71.11 LED11.A 14.22,68.59 14.22,71.12 | 14.22,71.12 20.57,71.12 | LED18.A 20.57,71.12 | 20.57,71.12 26.92,71.12 | 26.92,71.12 26.95,71.09 LED25.A 26.92,68.61 26.92,71.12 | 26.92,71.12 33.27,71.12 | LED32.A 33.27,71.12 | 33.27,71.12 39.62,71.12 | LED39.A 39.62,71.12 | 39.62,71.12 45.97,71.12 | LED46.A 45.97,71.12 | 45.97,71.12 52.32,71.12 | LED53.A 52.32,71.12 | 52.32,71.12 58.67,71.12 | LED60.A 58.67,71.12 | 58.67,71.12 65.02,71.12 | LED67.A 65.02,71.12 | 65.02,71.12 71.37,71.12 LED74.A
N$32
  Top 0.305: T6.E 7.87,78.74 | LED3.A 7.87,78.74 | 7.87,78.74 14.22,78.74 | LED10.A 14.22,78.74 | 14.22,78.74 20.57,78.74 | LED17.A 20.57,78.74 | 20.57,78.74 26.92,78.74 | LED24.A 26.92,78.74 | 26.92,78.74 33.27,78.74 | LED31.A 33.27,78.74 | 33.27,78.74 39.62,78.74 | LED38.A 39.62,78.74 | 39.62,78.74 45.97,78.74 | LED45.A 45.97,78.74 | 45.97,78.74 52.32,78.74 | LED52.A 52.32,78.74 | 52.32,78.74 58.67,78.74 | LED59.A 58.67,78.74 | 58.67,78.74 65.02,78.74 | LED66.A 65.02,78.74 | 65.02,78.74 71.37,78.74 LED73.A
N$33
  Bottom 0.254: LED2.K 11.67,83.84 11.67,76.2 | 11.67,76.01 10.42,76.01 LED3.K 11.67,76.2 | 11.67,76.2 11.67,76.01 | 11.67,76.01 11.67,68.57 | 11.67,68.51 10.41,68.51 LED4.K 11.67,68.57 | 11.67,68.57 11.67,68.51 | 11.67,68.51 11.92,68.51 11.92,60.97 | 11.67,60.76 10.41,60.76 LED5.K 11.92,60.97 | 11.92,60.97 11.92,60.76 11.67,60.76 | 11.67,60.76 11.67,53.26 10.43,53.26 LED6.K 11.67,53.35 11.67,45.26 10.42,45.26 LED7.K 11.42,45.71 11.42,45.51 11.67,45.51 11.67,38.01 10.4,38.01 LED8.K 11.67,38.08 11.67,28.26 10.33,28.26 T9.C